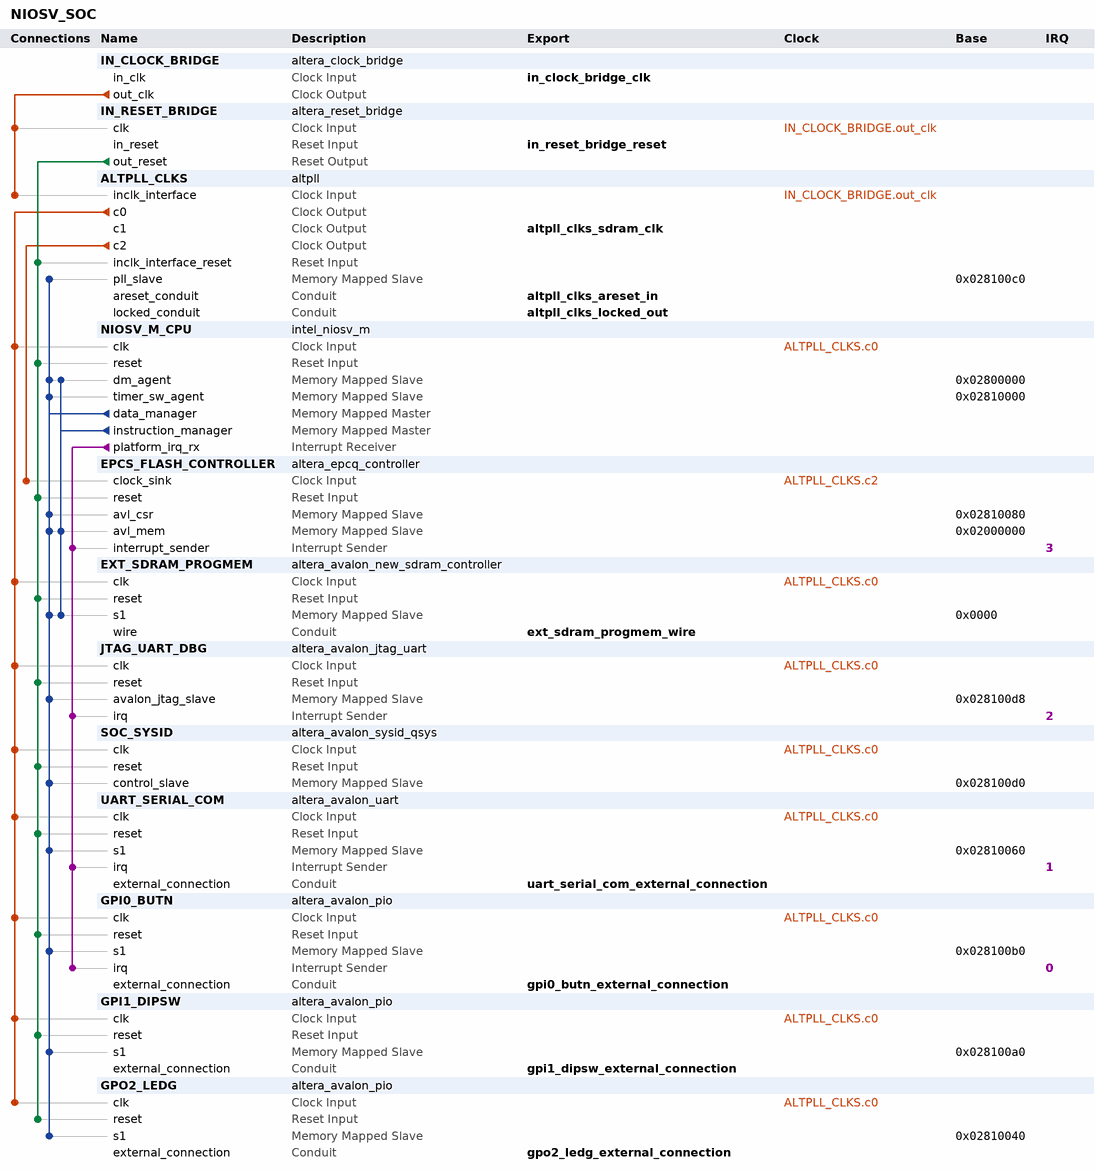
[diagram p0: system contents]
# Platform Designer (Qsys) system NIOSV_SOC, Cyclone IV E EP4CE22F17C6
# Parameters at their usual value, and those the tool derives, are not listed.
package require -exact qsys 23.1
create_system NIOSV_SOC
set_project_property DEVICE_FAMILY {Cyclone IV E}
set_project_property DEVICE EP4CE22F17C6

add_instance IN_CLOCK_BRIDGE altera_clock_bridge 23.1
set_instance_parameter_value IN_CLOCK_BRIDGE DERIVED_CLOCK_RATE 0
set_instance_parameter_value IN_CLOCK_BRIDGE EXPLICIT_CLOCK_RATE 50000000

add_instance IN_RESET_BRIDGE altera_reset_bridge 23.1
set_instance_parameter_value IN_RESET_BRIDGE ACTIVE_LOW_RESET 1
set_instance_parameter_value IN_RESET_BRIDGE SYNCHRONOUS_EDGES deassert

add_instance ALTPLL_CLKS altpll 23.1
set_instance_parameter_value ALTPLL_CLKS CLK0_DIVIDE_BY 1
set_instance_parameter_value ALTPLL_CLKS CLK0_MULTIPLY_BY 2
set_instance_parameter_value ALTPLL_CLKS CLK1_DIVIDE_BY 1
set_instance_parameter_value ALTPLL_CLKS CLK1_DUTY_CYCLE 50
set_instance_parameter_value ALTPLL_CLKS CLK1_MULTIPLY_BY 2
set_instance_parameter_value ALTPLL_CLKS CLK1_PHASE_SHIFT -1667
set_instance_parameter_value ALTPLL_CLKS CLK2_DIVIDE_BY 2
set_instance_parameter_value ALTPLL_CLKS CLK2_DUTY_CYCLE 50
set_instance_parameter_value ALTPLL_CLKS CLK2_MULTIPLY_BY 1
set_instance_parameter_value ALTPLL_CLKS CLK2_PHASE_SHIFT 0
set_instance_parameter_value ALTPLL_CLKS INCLK0_INPUT_FREQUENCY 20000
set_instance_parameter_value ALTPLL_CLKS PORT_ARESET PORT_USED
set_instance_parameter_value ALTPLL_CLKS PORT_LOCKED PORT_USED
set_instance_parameter_value ALTPLL_CLKS PORT_clk1 PORT_USED
set_instance_parameter_value ALTPLL_CLKS PORT_clk2 PORT_USED
set_instance_parameter_value ALTPLL_CLKS PORT_clk3 PORT_UNUSED

add_instance NIOSV_M_CPU intel_niosv_m 2.0.0
set_instance_parameter_value NIOSV_M_CPU clockFrequency 100000000
set_instance_parameter_value NIOSV_M_CPU enableDebugReset false
set_instance_parameter_value NIOSV_M_CPU enableECCLite true
set_instance_parameter_value NIOSV_M_CPU pipelineArch true
set_instance_parameter_value NIOSV_M_CPU resetOffset 1048576
set_instance_parameter_value NIOSV_M_CPU resetSlave EPCS_FLASH_CONTROLLER.avl_mem

add_instance EPCS_FLASH_CONTROLLER altera_epcq_controller 23.1
set_instance_parameter_value EPCS_FLASH_CONTROLLER CHIP_SELS 1
set_instance_parameter_value EPCS_FLASH_CONTROLLER DDASI 0
set_instance_parameter_value EPCS_FLASH_CONTROLLER FLASH_TYPE EPCS64
set_instance_parameter_value EPCS_FLASH_CONTROLLER IO_MODE STANDARD
set_instance_parameter_value EPCS_FLASH_CONTROLLER UNIQUE_ID {$${FILENAME}_EPCS_FLASH_CONTROLLER}
set_instance_parameter_value EPCS_FLASH_CONTROLLER clkFreq 25000000

add_instance EXT_SDRAM_PROGMEM altera_avalon_new_sdram_controller 20.1
set_instance_parameter_value EXT_SDRAM_PROGMEM TAC 5.5
set_instance_parameter_value EXT_SDRAM_PROGMEM TRCD 20.0
set_instance_parameter_value EXT_SDRAM_PROGMEM TRP 20.0
set_instance_parameter_value EXT_SDRAM_PROGMEM casLatency 3
set_instance_parameter_value EXT_SDRAM_PROGMEM columnWidth 9
set_instance_parameter_value EXT_SDRAM_PROGMEM dataWidth 16
set_instance_parameter_value EXT_SDRAM_PROGMEM generateSimulationModel true
set_instance_parameter_value EXT_SDRAM_PROGMEM model single_Micron_MT48LC4M32B2_7_chip
set_instance_parameter_value EXT_SDRAM_PROGMEM numberOfBanks 4
set_instance_parameter_value EXT_SDRAM_PROGMEM numberOfChipSelects 1
set_instance_parameter_value EXT_SDRAM_PROGMEM powerUpDelay 100.0
set_instance_parameter_value EXT_SDRAM_PROGMEM refreshPeriod 15.625
set_instance_parameter_value EXT_SDRAM_PROGMEM rowWidth 13

add_instance JTAG_UART_DBG altera_avalon_jtag_uart 23.1
set_instance_parameter_value JTAG_UART_DBG simInteractiveOptions NO_INTERACTIVE_WINDOWS

add_instance SOC_SYSID altera_avalon_sysid_qsys 23.1
set_instance_parameter_value SOC_SYSID id -559038737

add_instance UART_SERIAL_COM altera_avalon_uart 23.1
set_instance_parameter_value UART_SERIAL_COM baud 115200
set_instance_parameter_value UART_SERIAL_COM dataBits 8
set_instance_parameter_value UART_SERIAL_COM fixedBaud true
set_instance_parameter_value UART_SERIAL_COM parity NONE
set_instance_parameter_value UART_SERIAL_COM stopBits 1

add_instance GPI0_BUTN altera_avalon_pio 23.1
set_instance_parameter_value GPI0_BUTN bitClearingEdgeCapReg true
set_instance_parameter_value GPI0_BUTN captureEdge true
set_instance_parameter_value GPI0_BUTN direction Input
set_instance_parameter_value GPI0_BUTN edgeType FALLING
set_instance_parameter_value GPI0_BUTN generateIRQ true
set_instance_parameter_value GPI0_BUTN irqType EDGE
set_instance_parameter_value GPI0_BUTN width 1

add_instance GPI1_DIPSW altera_avalon_pio 23.1
set_instance_parameter_value GPI1_DIPSW bitClearingEdgeCapReg true
set_instance_parameter_value GPI1_DIPSW captureEdge true
set_instance_parameter_value GPI1_DIPSW direction Input
set_instance_parameter_value GPI1_DIPSW edgeType ANY
set_instance_parameter_value GPI1_DIPSW width 4

add_instance GPO2_LEDG altera_avalon_pio 23.1
set_instance_parameter_value GPO2_LEDG bitModifyingOutReg true
set_instance_parameter_value GPO2_LEDG direction Output
set_instance_parameter_value GPO2_LEDG width 8

# connections
add_connection ALTPLL_CLKS.c0 EXT_SDRAM_PROGMEM.clk clock
add_connection ALTPLL_CLKS.c0 GPI0_BUTN.clk clock
add_connection ALTPLL_CLKS.c0 GPI1_DIPSW.clk clock
add_connection ALTPLL_CLKS.c0 GPO2_LEDG.clk clock
add_connection ALTPLL_CLKS.c0 JTAG_UART_DBG.clk clock
add_connection ALTPLL_CLKS.c0 NIOSV_M_CPU.clk clock
add_connection ALTPLL_CLKS.c0 SOC_SYSID.clk clock
add_connection ALTPLL_CLKS.c0 UART_SERIAL_COM.clk clock
add_connection ALTPLL_CLKS.c2 EPCS_FLASH_CONTROLLER.clock_sink clock
add_connection IN_CLOCK_BRIDGE.out_clk ALTPLL_CLKS.inclk_interface clock
add_connection IN_CLOCK_BRIDGE.out_clk IN_RESET_BRIDGE.clk clock
add_connection IN_RESET_BRIDGE.out_reset ALTPLL_CLKS.inclk_interface_reset reset
add_connection IN_RESET_BRIDGE.out_reset EPCS_FLASH_CONTROLLER.reset reset
add_connection IN_RESET_BRIDGE.out_reset EXT_SDRAM_PROGMEM.reset reset
add_connection IN_RESET_BRIDGE.out_reset GPI0_BUTN.reset reset
add_connection IN_RESET_BRIDGE.out_reset GPI1_DIPSW.reset reset
add_connection IN_RESET_BRIDGE.out_reset GPO2_LEDG.reset reset
add_connection IN_RESET_BRIDGE.out_reset JTAG_UART_DBG.reset reset
add_connection IN_RESET_BRIDGE.out_reset NIOSV_M_CPU.reset reset
add_connection IN_RESET_BRIDGE.out_reset SOC_SYSID.reset reset
add_connection IN_RESET_BRIDGE.out_reset UART_SERIAL_COM.reset reset
add_connection NIOSV_M_CPU.data_manager ALTPLL_CLKS.pll_slave avalon
set_connection_parameter_value NIOSV_M_CPU.data_manager/ALTPLL_CLKS.pll_slave baseAddress 0x028100c0
add_connection NIOSV_M_CPU.data_manager EPCS_FLASH_CONTROLLER.avl_csr avalon
set_connection_parameter_value NIOSV_M_CPU.data_manager/EPCS_FLASH_CONTROLLER.avl_csr baseAddress 0x02810080
add_connection NIOSV_M_CPU.data_manager EPCS_FLASH_CONTROLLER.avl_mem avalon
set_connection_parameter_value NIOSV_M_CPU.data_manager/EPCS_FLASH_CONTROLLER.avl_mem baseAddress 0x02000000
add_connection NIOSV_M_CPU.data_manager EXT_SDRAM_PROGMEM.s1 avalon
set_connection_parameter_value NIOSV_M_CPU.data_manager/EXT_SDRAM_PROGMEM.s1 baseAddress 0x0000
add_connection NIOSV_M_CPU.data_manager GPI0_BUTN.s1 avalon
set_connection_parameter_value NIOSV_M_CPU.data_manager/GPI0_BUTN.s1 baseAddress 0x028100b0
add_connection NIOSV_M_CPU.data_manager GPI1_DIPSW.s1 avalon
set_connection_parameter_value NIOSV_M_CPU.data_manager/GPI1_DIPSW.s1 baseAddress 0x028100a0
add_connection NIOSV_M_CPU.data_manager GPO2_LEDG.s1 avalon
set_connection_parameter_value NIOSV_M_CPU.data_manager/GPO2_LEDG.s1 baseAddress 0x02810040
add_connection NIOSV_M_CPU.data_manager JTAG_UART_DBG.avalon_jtag_slave avalon
set_connection_parameter_value NIOSV_M_CPU.data_manager/JTAG_UART_DBG.avalon_jtag_slave baseAddress 0x028100d8
add_connection NIOSV_M_CPU.data_manager NIOSV_M_CPU.dm_agent avalon
set_connection_parameter_value NIOSV_M_CPU.data_manager/NIOSV_M_CPU.dm_agent baseAddress 0x02800000
add_connection NIOSV_M_CPU.data_manager NIOSV_M_CPU.timer_sw_agent avalon
set_connection_parameter_value NIOSV_M_CPU.data_manager/NIOSV_M_CPU.timer_sw_agent baseAddress 0x02810000
add_connection NIOSV_M_CPU.data_manager SOC_SYSID.control_slave avalon
set_connection_parameter_value NIOSV_M_CPU.data_manager/SOC_SYSID.control_slave baseAddress 0x028100d0
add_connection NIOSV_M_CPU.data_manager UART_SERIAL_COM.s1 avalon
set_connection_parameter_value NIOSV_M_CPU.data_manager/UART_SERIAL_COM.s1 baseAddress 0x02810060
add_connection NIOSV_M_CPU.instruction_manager EPCS_FLASH_CONTROLLER.avl_mem avalon
set_connection_parameter_value NIOSV_M_CPU.instruction_manager/EPCS_FLASH_CONTROLLER.avl_mem baseAddress 0x02000000
add_connection NIOSV_M_CPU.instruction_manager EXT_SDRAM_PROGMEM.s1 avalon
set_connection_parameter_value NIOSV_M_CPU.instruction_manager/EXT_SDRAM_PROGMEM.s1 baseAddress 0x0000
add_connection NIOSV_M_CPU.instruction_manager NIOSV_M_CPU.dm_agent avalon
set_connection_parameter_value NIOSV_M_CPU.instruction_manager/NIOSV_M_CPU.dm_agent baseAddress 0x02800000
add_connection NIOSV_M_CPU.platform_irq_rx EPCS_FLASH_CONTROLLER.interrupt_sender interrupt
set_connection_parameter_value NIOSV_M_CPU.platform_irq_rx/EPCS_FLASH_CONTROLLER.interrupt_sender irqNumber 3
add_connection NIOSV_M_CPU.platform_irq_rx GPI0_BUTN.irq interrupt
set_connection_parameter_value NIOSV_M_CPU.platform_irq_rx/GPI0_BUTN.irq irqNumber 0
add_connection NIOSV_M_CPU.platform_irq_rx JTAG_UART_DBG.irq interrupt
set_connection_parameter_value NIOSV_M_CPU.platform_irq_rx/JTAG_UART_DBG.irq irqNumber 2
add_connection NIOSV_M_CPU.platform_irq_rx UART_SERIAL_COM.irq interrupt
set_connection_parameter_value NIOSV_M_CPU.platform_irq_rx/UART_SERIAL_COM.irq irqNumber 1

# exported interfaces
add_interface altpll_clks_areset_in conduit end
set_interface_property altpll_clks_areset_in EXPORT_OF ALTPLL_CLKS.areset_conduit
add_interface altpll_clks_locked_out conduit end
set_interface_property altpll_clks_locked_out EXPORT_OF ALTPLL_CLKS.locked_conduit
add_interface altpll_clks_sdram_clk clock source
set_interface_property altpll_clks_sdram_clk EXPORT_OF ALTPLL_CLKS.c1
add_interface ext_sdram_progmem_wire conduit end
set_interface_property ext_sdram_progmem_wire EXPORT_OF EXT_SDRAM_PROGMEM.wire
add_interface gpi0_butn_external_connection conduit end
set_interface_property gpi0_butn_external_connection EXPORT_OF GPI0_BUTN.external_connection
add_interface gpi1_dipsw_external_connection conduit end
set_interface_property gpi1_dipsw_external_connection EXPORT_OF GPI1_DIPSW.external_connection
add_interface gpo2_ledg_external_connection conduit end
set_interface_property gpo2_ledg_external_connection EXPORT_OF GPO2_LEDG.external_connection
add_interface in_clock_bridge_clk clock sink
set_interface_property in_clock_bridge_clk EXPORT_OF IN_CLOCK_BRIDGE.in_clk
add_interface in_reset_bridge_reset reset sink
set_interface_property in_reset_bridge_reset EXPORT_OF IN_RESET_BRIDGE.in_reset
add_interface uart_serial_com_external_connection conduit end
set_interface_property uart_serial_com_external_connection EXPORT_OF UART_SERIAL_COM.external_connection

set_interconnect_requirement {$system} qsys_mm.clockCrossingAdapter HANDSHAKE
set_interconnect_requirement {$system} qsys_mm.enableEccProtection FALSE
set_interconnect_requirement {$system} qsys_mm.insertDefaultSlave FALSE
set_interconnect_requirement {$system} qsys_mm.maxAdditionalLatency 1

save_system NIOSV_SOC.qsys
